# Altium schematic sheet Overall_Schematic.SchDoc
size Letter; SheetNumber: 1; SheetTotal: 5
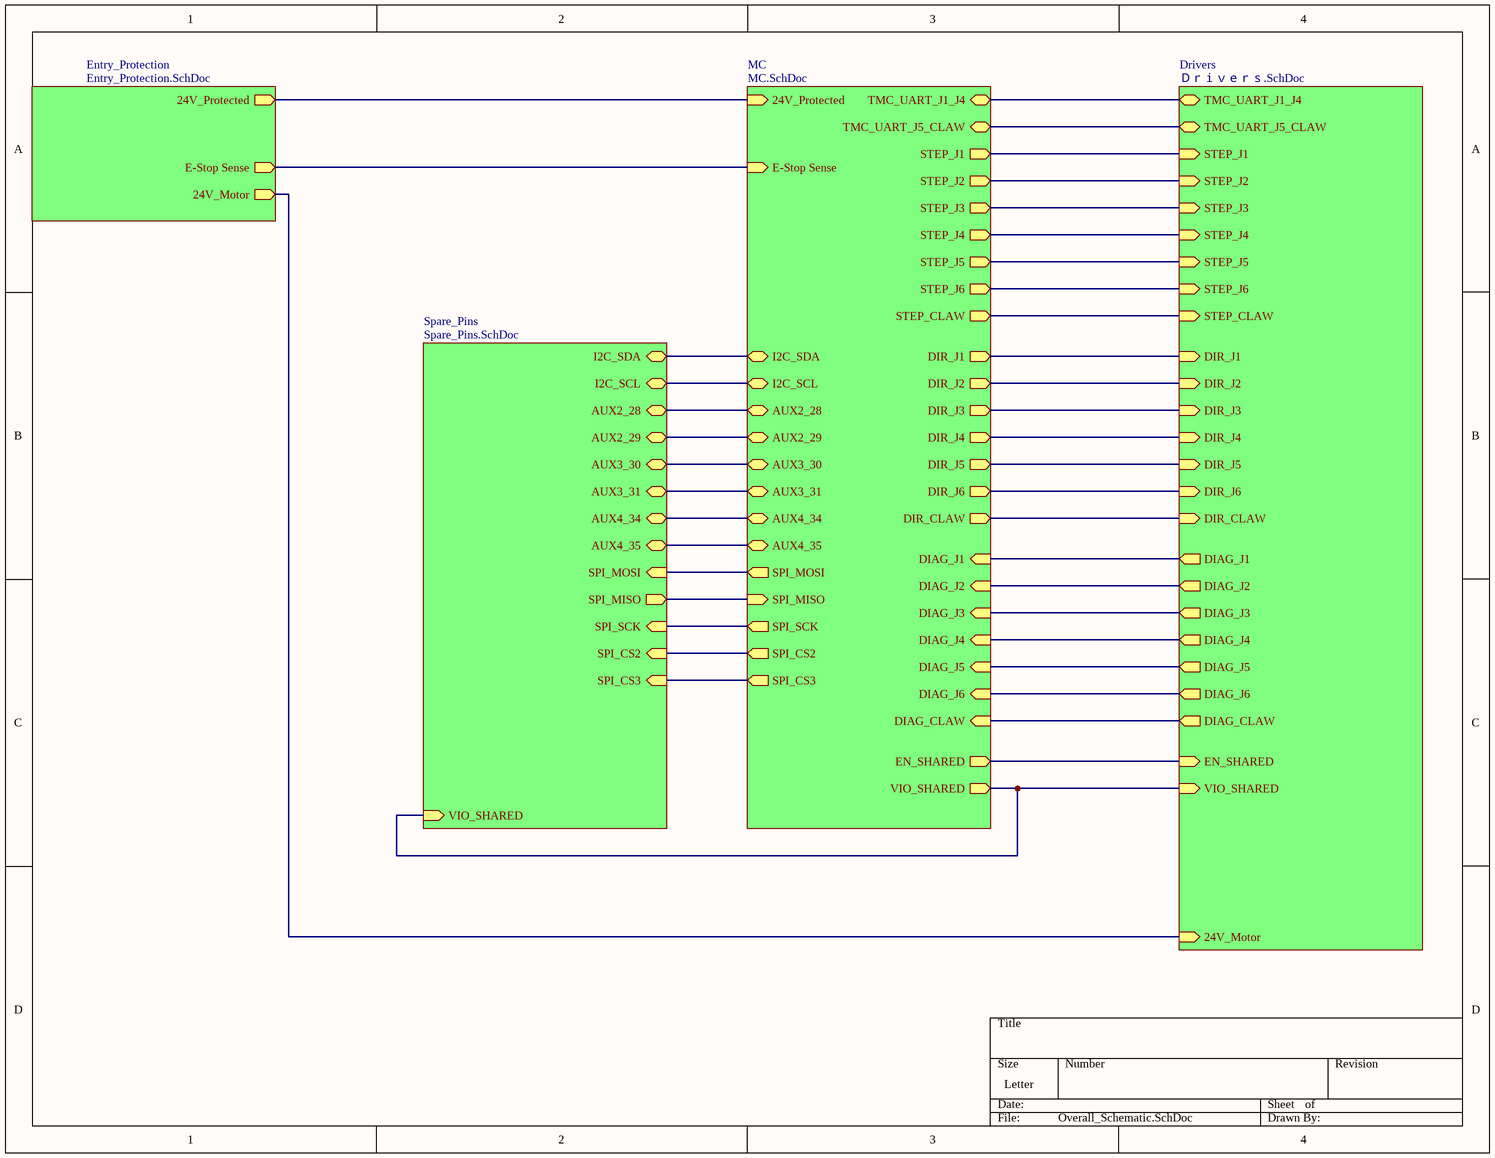
[diagram p0: Overall_Schematic.SchDoc]

## Sub-sheets
Drivers = Ｄｒｉｖｅｒｓ.SchDoc: TMC_UART_J1_J4 (bidir), TMC_UART_J5_CLAW (bidir), STEP_CLAW (in), STEP_J6 (in), STEP_J5 (in), STEP_J4 (in), STEP_J3 (in), STEP_J2 (in), STEP_J1 (in), DIR_J1 (in), DIR_J2 (in), DIR_J3 (in), DIR_J4 (in), DIR_J5 (in), DIR_J6 (in), DIR_CLAW (in), DIAG_CLAW (out), DIAG_J6 (out), DIAG_J5 (out), DIAG_J4 (out), DIAG_J3 (out), DIAG_J2 (out), DIAG_J1 (out), EN_SHARED (in), VIO_SHARED (in), 24V_Motor (in)
Entry_Protection = Entry_Protection.SchDoc: 24V_Protected (out), 24V_Motor (out), E-Stop Sense (out)
MC = MC.SchDoc: 24V_Protected (in), TMC_UART_J1_J4 (bidir), TMC_UART_J5_CLAW (bidir), STEP_J1 (out), STEP_J2 (out), STEP_J3 (out), STEP_J4 (out), STEP_J5 (out), STEP_J6 (out), STEP_CLAW (out), DIR_J1 (out), DIR_J2 (out), DIR_J3 (out), DIR_J4 (out), DIR_J5 (out), DIR_J6 (out), DIR_CLAW (out), DIAG_J1 (in), DIAG_J2 (in), DIAG_J3 (in), DIAG_J4 (in), DIAG_J5 (in), DIAG_J6 (in), DIAG_CLAW (in), EN_SHARED (out), VIO_SHARED (out), E-Stop Sense (in), I2C_SDA (bidir), I2C_SCL (bidir), AUX2_28 (bidir), AUX2_29 (bidir), AUX3_30 (bidir), AUX3_31 (bidir), AUX4_34 (bidir), AUX4_35 (bidir), SPI_MOSI (out), SPI_MISO (in), SPI_SCK (out), SPI_CS2 (out), SPI_CS3 (out)
Spare_Pins = Spare_Pins.SchDoc: VIO_SHARED (in), I2C_SDA (bidir), I2C_SCL (bidir), AUX2_28 (bidir), AUX2_29 (bidir), AUX3_30 (bidir), AUX3_31 (bidir), AUX4_34 (bidir), AUX4_35 (bidir), SPI_MOSI (in), SPI_MISO (out), SPI_SCK (in), SPI_CS2 (in), SPI_CS3 (in)

## Nets
(unnamed): sheet Entry_Protection/24V_Protected, sheet MC/24V_Protected
(unnamed): sheet Entry_Protection/24V_Motor, sheet Drivers/24V_Motor
(unnamed): sheet Entry_Protection/E-Stop Sense, sheet MC/E-Stop Sense
(unnamed): sheet MC/TMC_UART_J1_J4, sheet Drivers/TMC_UART_J1_J4
(unnamed): sheet MC/TMC_UART_J5_CLAW, sheet Drivers/TMC_UART_J5_CLAW
(unnamed): sheet MC/STEP_J1, sheet Drivers/STEP_J1
(unnamed): sheet MC/STEP_J2, sheet Drivers/STEP_J2
(unnamed): sheet MC/STEP_J3, sheet Drivers/STEP_J3
(unnamed): sheet MC/STEP_J4, sheet Drivers/STEP_J4
(unnamed): sheet MC/STEP_J5, sheet Drivers/STEP_J5
(unnamed): sheet MC/STEP_J6, sheet Drivers/STEP_J6
(unnamed): sheet MC/STEP_CLAW, sheet Drivers/STEP_CLAW
(unnamed): sheet MC/DIR_J1, sheet Drivers/DIR_J1
(unnamed): sheet MC/DIR_J2, sheet Drivers/DIR_J2
(unnamed): sheet MC/DIR_J3, sheet Drivers/DIR_J3
(unnamed): sheet MC/DIR_J4, sheet Drivers/DIR_J4
(unnamed): sheet MC/DIR_J5, sheet Drivers/DIR_J5
(unnamed): sheet MC/DIR_J6, sheet Drivers/DIR_J6
(unnamed): sheet MC/DIR_CLAW, sheet Drivers/DIR_CLAW
(unnamed): sheet MC/DIAG_J1, sheet Drivers/DIAG_J1
(unnamed): sheet MC/DIAG_J2, sheet Drivers/DIAG_J2
(unnamed): sheet MC/DIAG_J3, sheet Drivers/DIAG_J3
(unnamed): sheet MC/DIAG_J4, sheet Drivers/DIAG_J4
(unnamed): sheet MC/DIAG_J5, sheet Drivers/DIAG_J5
(unnamed): sheet MC/DIAG_J6, sheet Drivers/DIAG_J6
(unnamed): sheet MC/DIAG_CLAW, sheet Drivers/DIAG_CLAW
(unnamed): sheet MC/EN_SHARED, sheet Drivers/EN_SHARED
(unnamed): sheet MC/VIO_SHARED, sheet Drivers/VIO_SHARED, sheet Spare_Pins/VIO_SHARED
(unnamed): sheet MC/I2C_SDA, sheet Spare_Pins/I2C_SDA
(unnamed): sheet MC/I2C_SCL, sheet Spare_Pins/I2C_SCL
(unnamed): sheet MC/AUX2_28, sheet Spare_Pins/AUX2_28
(unnamed): sheet MC/AUX2_29, sheet Spare_Pins/AUX2_29
(unnamed): sheet MC/AUX3_30, sheet Spare_Pins/AUX3_30
(unnamed): sheet MC/AUX3_31, sheet Spare_Pins/AUX3_31
(unnamed): sheet MC/AUX4_34, sheet Spare_Pins/AUX4_34
(unnamed): sheet MC/AUX4_35, sheet Spare_Pins/AUX4_35
(unnamed): sheet MC/SPI_MOSI, sheet Spare_Pins/SPI_MOSI
(unnamed): sheet MC/SPI_MISO, sheet Spare_Pins/SPI_MISO
(unnamed): sheet MC/SPI_SCK, sheet Spare_Pins/SPI_SCK
(unnamed): sheet MC/SPI_CS2, sheet Spare_Pins/SPI_CS2
(unnamed): sheet MC/SPI_CS3, sheet Spare_Pins/SPI_CS3